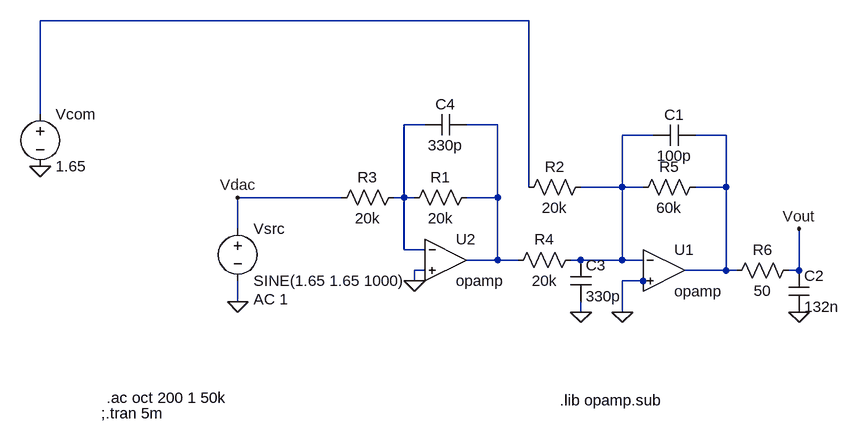
[diagram p0: schematic OutputStage.asc]
OutputStage.asc, the LTspice schematic file:
Version 4
SHEET 1 880 680
WIRE 208 -208 -544 -208
WIRE -544 -64 -544 -208
WIRE 48 -48 16 -48
WIRE 160 -48 112 -48
WIRE 400 -32 352 -32
WIRE 512 -32 464 -32
WIRE 208 48 208 -208
WIRE 352 48 352 -32
WIRE 352 48 288 48
WIRE 384 48 352 48
WIRE 512 48 512 -32
WIRE 512 48 464 48
WIRE -80 64 -240 64
WIRE 16 64 16 -48
WIRE 16 64 0 64
WIRE 32 64 16 64
WIRE 160 64 160 -48
WIRE 160 64 112 64
WIRE -240 112 -240 64
WIRE 16 144 16 64
WIRE 48 144 16 144
WIRE 160 160 160 64
WIRE 160 160 112 160
WIRE 192 160 160 160
WIRE 288 160 272 160
WIRE 352 160 352 48
WIRE 352 160 288 160
WIRE 384 160 352 160
WIRE 48 176 32 176
WIRE 512 176 512 48
WIRE 512 176 448 176
WIRE 528 176 512 176
WIRE 624 176 624 112
WIRE 624 176 608 176
WIRE 32 192 32 176
WIRE 384 192 352 192
WIRE 400 192 384 192
WIRE -240 224 -240 192
WIRE 288 240 288 224
WIRE 352 240 352 192
FLAG -240 224 0
FLAG 352 240 0
FLAG 624 112 Vout
FLAG 624 240 0
FLAG -240 64 Vdac
FLAG 288 240 0
FLAG -544 16 0
FLAG 32 192 0
SYMBOL Opamps\\opamp 416 112 R0
SYMATTR InstName U1
SYMBOL Opamps\\opamp 80 96 R0
SYMATTR InstName U2
SYMBOL voltage -544 -80 R0
WINDOW 123 0 0 Left 2
WINDOW 39 0 0 Left 2
SYMATTR InstName Vcom
SYMATTR Value 1.65
SYMBOL voltage -240 96 R0
WINDOW 123 24 124 Left 2
WINDOW 39 0 0 Left 2
SYMATTR InstName Vsrc
SYMATTR Value SINE(1.65 1.65 1000)
SYMATTR Value2 AC 1
SYMBOL res 128 48 R90
WINDOW 0 0 56 VBottom 2
WINDOW 3 32 56 VTop 2
SYMATTR InstName R1
SYMATTR Value 20k
SYMBOL res 16 48 R90
WINDOW 0 0 56 VBottom 2
WINDOW 3 32 56 VTop 2
SYMATTR InstName R3
SYMATTR Value 20k
SYMBOL res 288 144 R90
WINDOW 0 0 56 VBottom 2
WINDOW 3 32 56 VTop 2
SYMATTR InstName R4
SYMATTR Value 20k
SYMBOL res 480 32 R90
WINDOW 0 0 56 VBottom 2
WINDOW 3 32 56 VTop 2
SYMATTR InstName R5
SYMATTR Value 60k
SYMBOL cap 464 -48 R90
WINDOW 0 0 32 VBottom 2
WINDOW 3 32 32 VTop 2
SYMATTR InstName C1
SYMATTR Value 100p
SYMBOL cap 608 240 M180
WINDOW 0 24 56 Left 2
WINDOW 3 24 8 Left 2
SYMATTR InstName C2
SYMATTR Value 132n
SYMBOL res 624 160 R90
WINDOW 0 0 56 VBottom 2
WINDOW 3 32 56 VTop 2
SYMATTR InstName R6
SYMATTR Value 50
SYMBOL cap 272 224 M180
WINDOW 0 24 56 Left 2
WINDOW 3 24 8 Left 2
SYMATTR InstName C3
SYMATTR Value 330p
SYMBOL cap 112 -64 R90
WINDOW 0 0 32 VBottom 2
WINDOW 3 32 32 VTop 2
SYMATTR InstName C4
SYMATTR Value 330p
SYMBOL res 304 32 R90
WINDOW 0 0 56 VBottom 2
WINDOW 3 32 56 VTop 2
SYMATTR InstName R2
SYMATTR Value 20k
TEXT 256 376 Left 2 !.lib opamp.sub
TEXT -450 396 Left 2 !;.tran 5m
TEXT -442 372 Left 2 !.ac oct 200 1 50k

The netlist it stands for:
* OutputStage.asc
XU1 N004 0 N005 opamp Aol=100K GBW=10Meg  ; pins invin noninvin out
XU2 N002 0 N003 opamp Aol=100K GBW=10Meg  ; pins invin noninvin out
Vcom N001 0 1.65
Vsrc Vdac 0 SINE(1.65 1.65 1000) AC 1
R1 N003 N002 20k
R3 N002 Vdac 20k
R4 N004 N003 20k
R5 N005 N004 60k
C1 N005 N004 100p
C2 0 Vout 132n
R6 Vout N005 50
C3 0 N004 330p
C4 N003 N002 330p
R2 N004 N001 20k
.lib opamp.sub
;.tran 5m
.ac oct 200 1 50k
.backanno
.end